# Altium schematic sheet 01_System.SchDoc
size A4
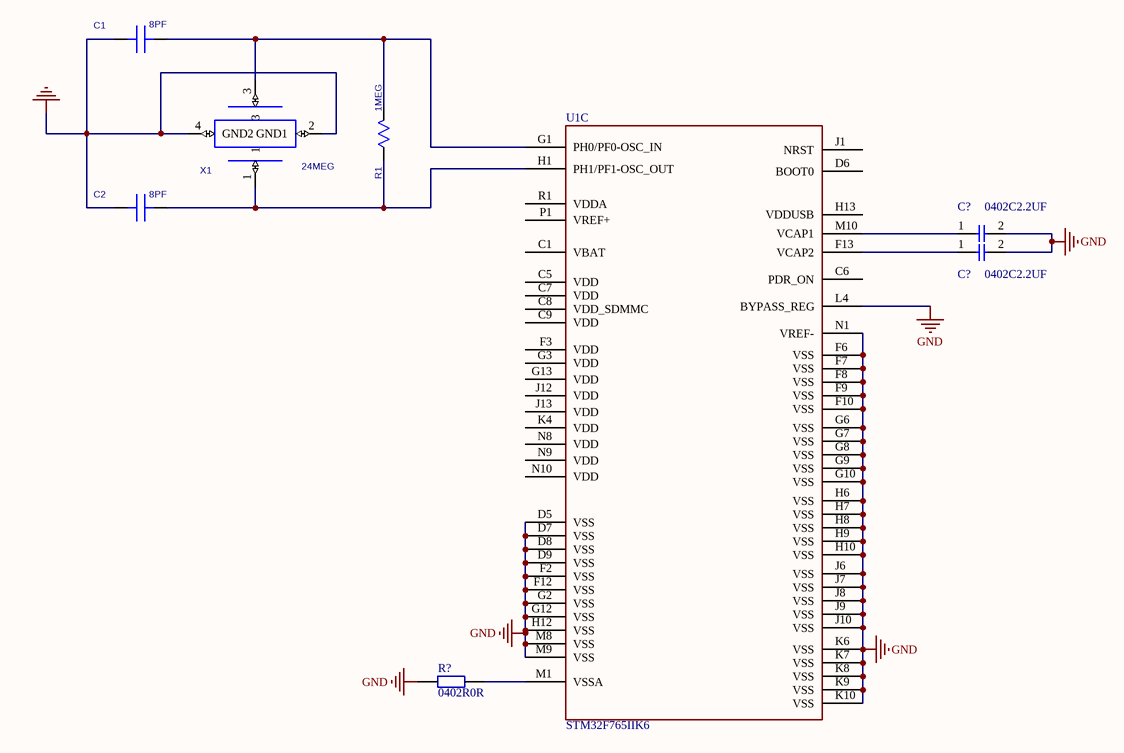
[diagram p0: 01_System.SchDoc]

## Parts
(Parts that share a designator on the sheet are numbered #1, #2 ... from top to bottom, then left to right.)
C1  8PF  [SC0402]
C2  8PF  [SC0402]
C?#1  0402C2.2UF  [0402C]
C?#2  0402C2.2UF  [0402C]
R1  1MEG  [SR0402]
R?  0402R0R  [0402R]
U1  STM32F765IIK6  [UFBGA176]  (part C of 3)
X1  24MEG  [3225]

## Nets
GND: C1.1(A) C2.1(A) C?#1.2 C?#2.2 R?.1 U1.D5(VSS) U1.D7(VSS) U1.D8(VSS) U1.D9(VSS) U1.F2(VSS) U1.F6(VSS) U1.F7(VSS) U1.F8(VSS) U1.F9(VSS) U1.F10(VSS) U1.F12(VSS) U1.G2(VSS) U1.G6(VSS) U1.G7(VSS) U1.G8(VSS) U1.G9(VSS) U1.G10(VSS) U1.G12(VSS) U1.H6(VSS) U1.H7(VSS) U1.H8(VSS) U1.H9(VSS) U1.H10(VSS) U1.H12(VSS) U1.J6(VSS) U1.J7(VSS) U1.J8(VSS) U1.J9(VSS) U1.J10(VSS) U1.K6(VSS) U1.K7(VSS) U1.K8(VSS) U1.K9(VSS) U1.K10(VSS) U1.L4(BYPASS_REG) U1.M8(VSS) U1.M9(VSS) U1.N1(VREF-) X1.2(GND1) X1.4(GND2)
NetC1_2: C1.2(B) R1.2(B) U1.G1(PH0/PF0-OSC_IN) X1.3
NetC2_2: C2.2(B) R1.1(A) U1.H1(PH1/PF1-OSC_OUT) X1.1
NetC?#1_1: C?#1.1 U1.M10(VCAP1)
NetC?#2_1: C?#2.1 U1.F13(VCAP2)
NetR?_2: R?.2 U1.M1(VSSA)

Not connected (* = marked no-connect by the designer): U1 C1(VBAT) C5(VDD) C6(PDR_ON) C7(VDD) C8(VDD_SDMMC) C9(VDD) D6(BOOT0) F3(VDD) G3(VDD) G13(VDD) H13(VDDUSB) J1(NRST) J12(VDD) J13(VDD) K4(VDD) N8(VDD) N9(VDD) N10(VDD) P1(VREF+) R1(VDDA)

## Library data of the parts
C1 C2 = C
R1 = R
R? = 0402R0R: 0402R0R 1%
X1 = X_B